# EAGLE design Prius Adaptor PCB Straight (EAGLE 9.4.0)
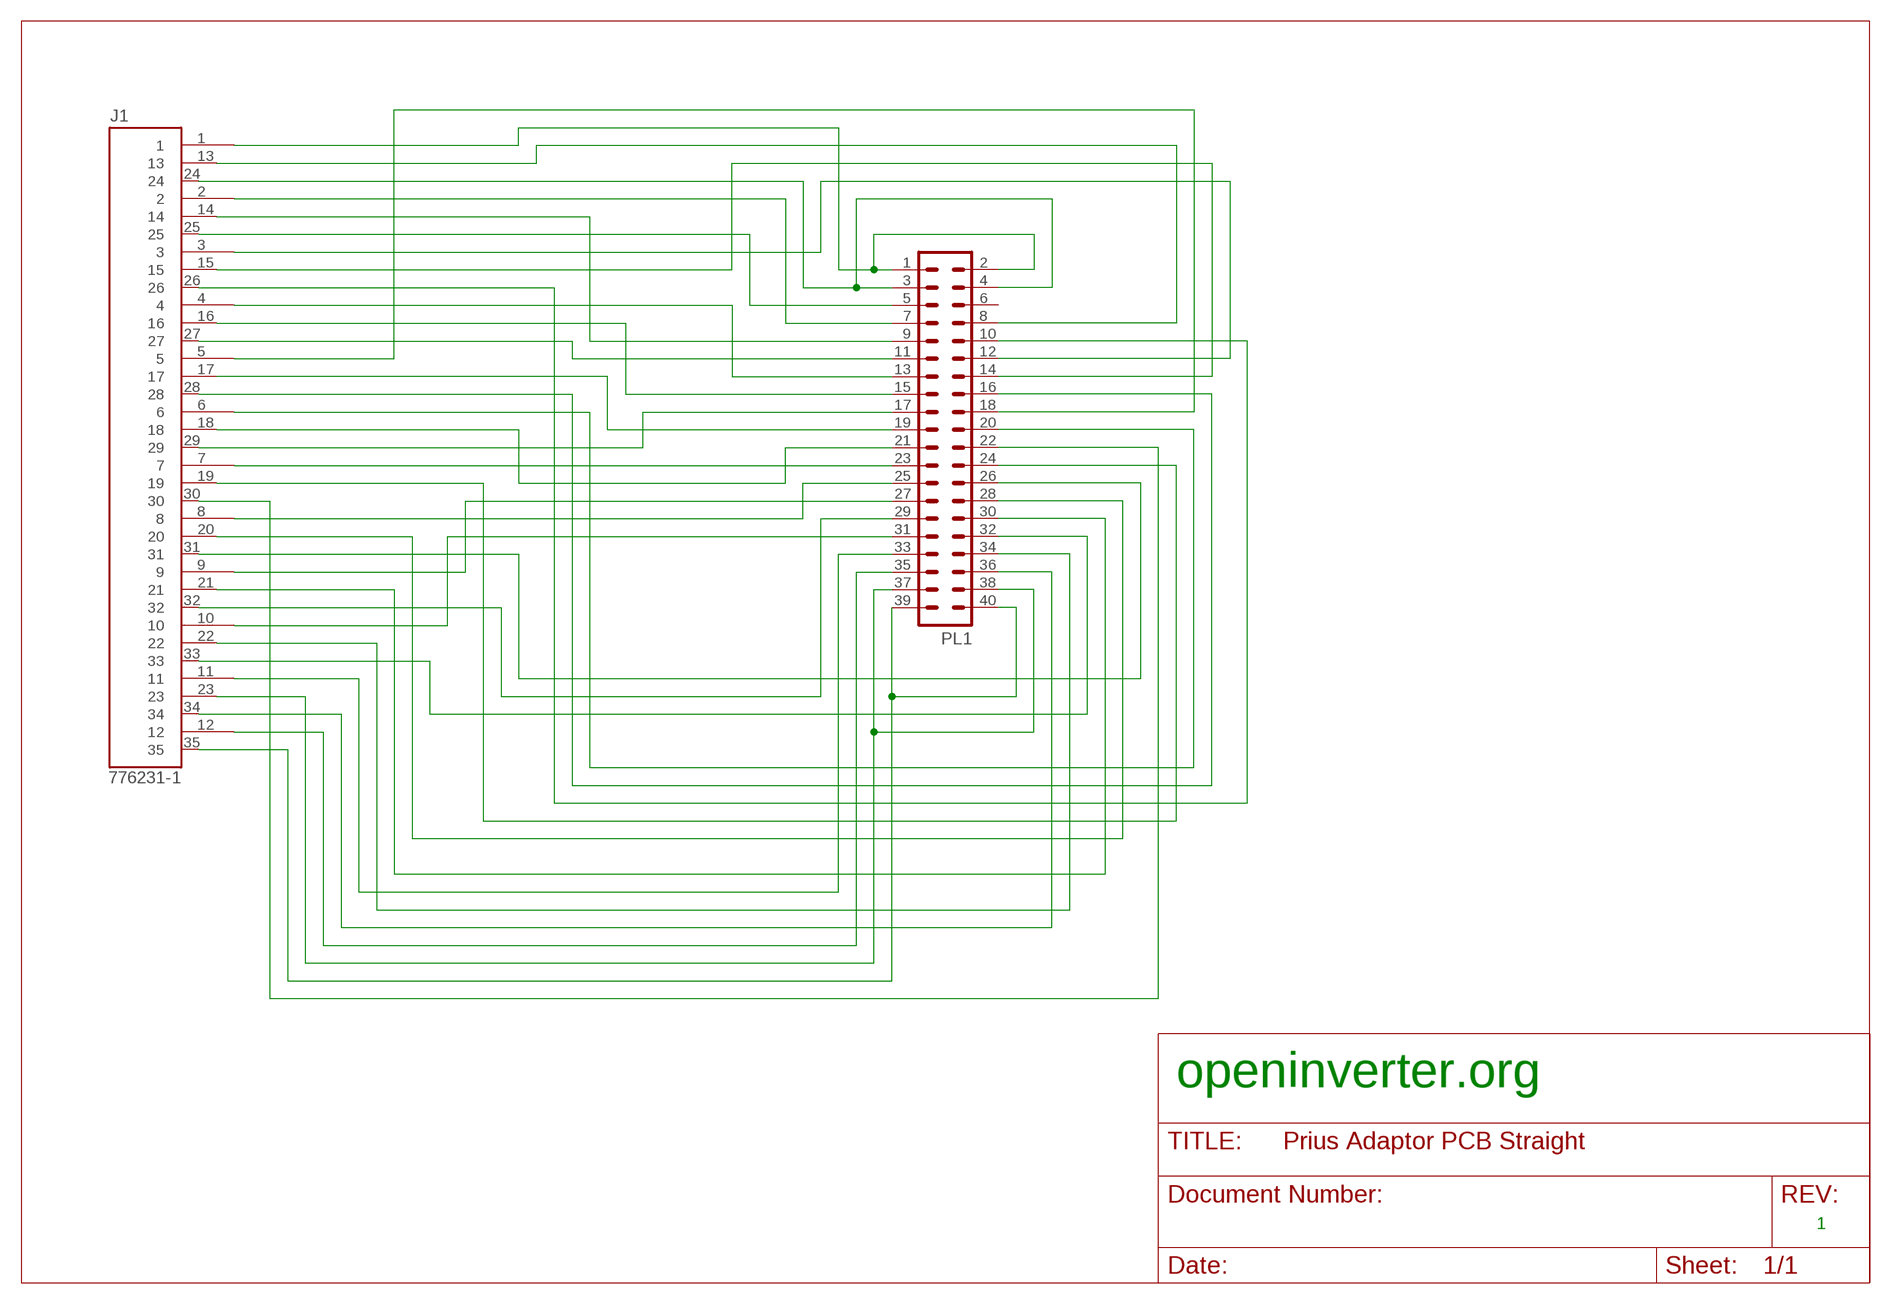
[diagram p0: schematic, sheet 1]

## Parts
J1  776231-1  [TE_776231-1]
PL1  40HNONLATCH  [40HNONLATCH]

## Nets
N$2: J1.6 PL1.20
N$3: J1.29 PL1.17
N$4: J1.5 PL1.18
N$5: J1.16 PL1.15
N$6: J1.28 PL1.16
N$7: J1.4 PL1.13
N$8: J1.15 PL1.14
N$9: J1.27 PL1.11
N$10: J1.17 PL1.19
N$11: J1.14 PL1.9
N$12: J1.26 PL1.10
N$13: J1.2 PL1.7
N$14: J1.13 PL1.8
N$15: J1.25 PL1.5
N$16 [Power]: J1.1 PL1.1 PL1.2
N$17 [Power]: J1.24 PL1.3 PL1.4
N$18: J1.7 PL1.23
N$19: J1.18 PL1.21
N$20: J1.30 PL1.22
N$21: J1.8 PL1.25
N$22: J1.19 PL1.24
N$23: J1.31 PL1.26
N$24: J1.9 PL1.27
N$25: J1.20 PL1.28
N$26: J1.32 PL1.29
N$27: J1.10 PL1.31
N$28: J1.21 PL1.30
N$29: J1.33 PL1.32
N$30: J1.11 PL1.33
N$31: J1.22 PL1.34
N$32: J1.34 PL1.36
N$33: J1.12 PL1.35
N$34 [Power]: J1.23 PL1.37 PL1.38
N$35 [Power]: J1.35 PL1.39 PL1.40
N$36: J1.3 PL1.12
Unconnected: PL1.6

## Notes on the sheet
- openinverter.org
- 1

## Library data of the parts
J1 = Prius Inverter Adaptor:776231-1: CONN HEADER 35POS VERT TIN BLK; MANUFACTURER: TE CONNECTIVITY; PARTREV: A13; STANDARD: MANUFACTURER RECOMMENDATIONS
PL1 = Prius Inverter Adaptor:40HNONLATCH: CONNECTOR

## Net classes
0 default: width 0.4 mm, clearance 0.3 mm
1 Signal: width 0.3 mm, clearance 0.2 mm
2 Power: width 1 mm, clearance 0.3 mm

## Board
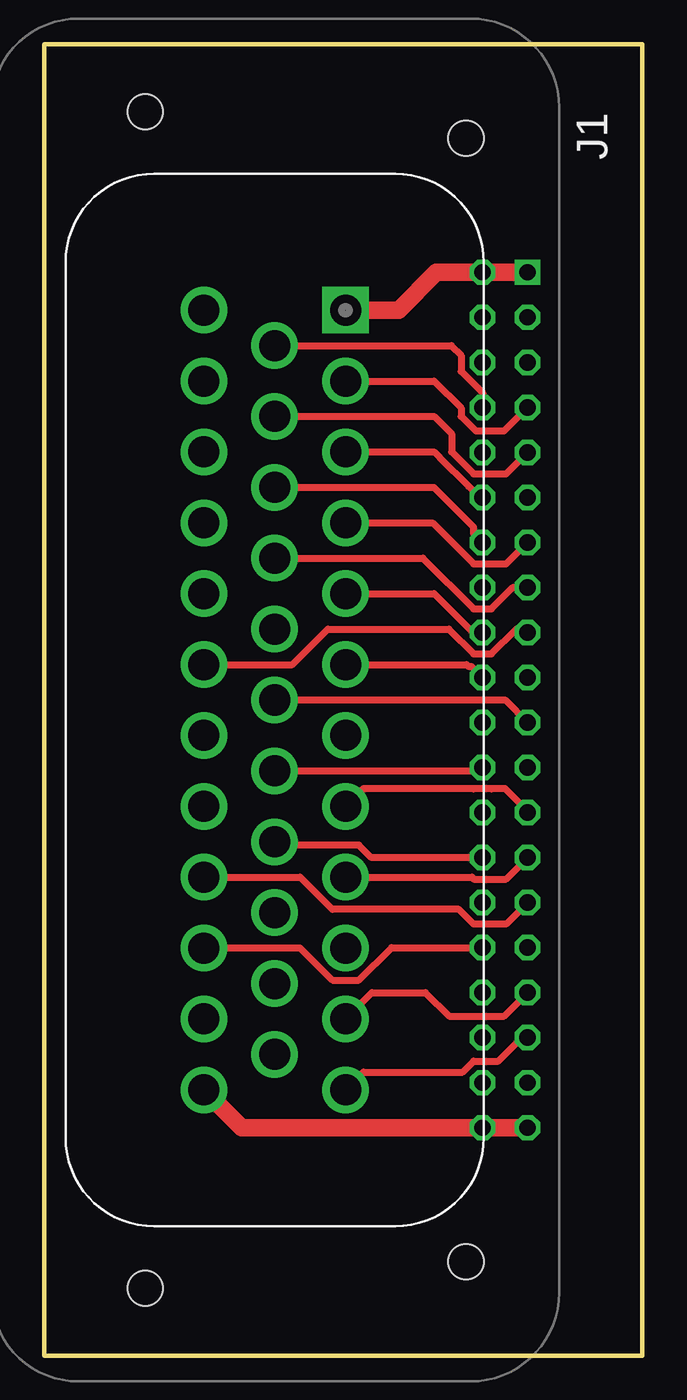
[diagram p1: board, top side]
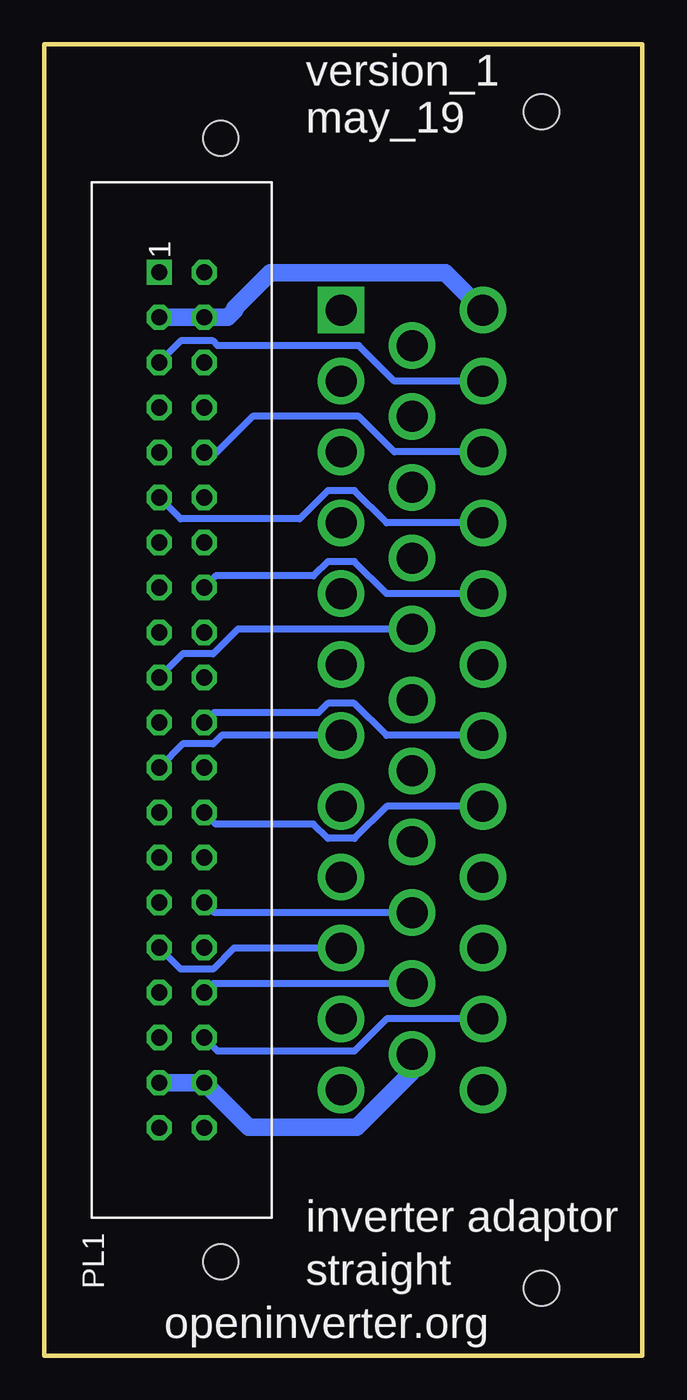
[diagram p2: board, bottom side, seen from below]

Size 33.75 x 74 mm. Coordinates in mm from the lower left corner, seen from the top.
Outline: 0,0 33.75,0 33.75,74 0,74 0,0
Copper layers (1*16): Top 0.035mm / dielectric 1.5mm / Bottom 0.035mm
Design rules "default": minimum track width 6mil, minimum drill 0.35mm, track to track 6mil, track to pad 6mil, pad to pad 6mil, via to via 6mil, smd to smd 6mil, copper to edge 40mil, drill to drill 6mil, minimum pad ring 10mil, minimum via ring 8mil, stop-mask expansion 4mil, vias tented up to drill 0mil, thermal gap 10mil

### Footprints (pad centres in the part's own frame; a part is rotated, then mirrored left to right if it is on the bottom)
TE_776231-1 = drill 1.75 square: 1 -22,4 | drill 1.75: 2 -18,4; 3 -14,4; 4 -10,4; 5 -6,4; 6 -2,4; 7 2,4; 8 6,4; 9 10,4; 10 14,4; 11 18,4; 12 22,4; 13 -20,0; 14 -16,0; 15 -12,0; 16 -8,0; 17 -4,0; 18 0,0; 19 4,0; 20 8,0; 21 12,0; 22 16,0; 23 20,0; 24 -22,-4; 25 -18,-4; 26 -14,-4; 27 -10,-4; 28 -6,-4; 29 -2,-4; 30 2,-4; 31 6,-4; 32 10,-4; 33 14,-4; 34 18,-4; 35 22,-4 | hole 2: -31.7,10.8; -33.2,-7.3; 31.7,10.8; 33.2,-7.3
40HNONLATCH = drill 0.914 square: 1 -24.13,-1.27 | drill 0.914 octagon: 2 -24.13,1.27; 3 -21.59,-1.27; 4 -21.59,1.27; 5 -19.05,-1.27; 6 -19.05,1.27; 7 -16.51,-1.27; 8 -16.51,1.27; 9 -13.97,-1.27; 10 -13.97,1.27; 11 -11.43,-1.27; 12 -11.43,1.27; 13 -8.89,-1.27; 14 -8.89,1.27; 15 -6.35,-1.27; 16 -6.35,1.27; 17 -3.81,-1.27; 18 -3.81,1.27; 19 -1.27,-1.27; 20 -1.27,1.27; 21 1.27,-1.27; 22 1.27,1.27; 23 3.81,-1.27; 24 3.81,1.27; 25 6.35,-1.27; 26 6.35,1.27; 27 8.89,-1.27; 28 8.89,1.27; 29 11.43,-1.27; 30 11.43,1.27; 31 13.97,-1.27; 32 13.97,1.27; 33 16.51,-1.27; 34 16.51,1.27; 35 19.05,-1.27; 36 19.05,1.27; 37 21.59,-1.27; 38 21.59,1.27; 39 24.13,-1.27; 40 24.13,1.27

### Placement (x,y rotation side)
J1  13,37 270 top
PL1  26,37 270 bottom

### Tracks (layer width: path | path; a pad name or v marks a point on that pad's centre or on a via)
N$2
  Top 0.4: J1.6 23.84,39 23.94,38.9 24.1,38.9 PL1.20
N$3
  Top 0.4: J1.29 14,39 16,41 22.83,41 24.23,39.6 25.23,39.6 26.63,41 27.08,41 PL1.17
N$4
  Top 0.4: J1.5 22,43 24.19,40.81 PL1.18
N$5
  Top 0.4: PL1.15 26.44,43.35 25.23,42.14 24.23,42.14 21.37,45 J1.16
N$6
  Bottom 0.4: J1.28 14.44,43 16.25,44.81 17.75,44.81 18.56,44 24.08,44 PL1.16
N$7
  Top 0.4: J1.4 21.91,47 24.23,44.68 26.06,44.68 PL1.13
N$8
  Top 0.4: PL1.14 24.22,46.4 24.22,46.77 21.99,49 J1.15
N$9
  Bottom 0.4: J1.27 14.44,47 16.25,48.81 17.75,48.81 19.34,47.22 26.06,47.22 PL1.11
N$10
  Bottom 0.4: J1.17 22.83,41 24.23,39.6 25.94,39.6 PL1.19
N$11
  Top 0.4: J1.14 22,53 22.99,52.01 22.99,51 24.23,49.76 26.06,49.76 PL1.9
N$12
  Bottom 0.4: J1.26 14,51 16,53 22,53 24.03,50.97 PL1.10
N$13
  Top 0.4: J1.2 22,55 23.52,53.48 23.52,53.01 24.35,52.18 25.94,52.18 PL1.7
N$14
  Top 0.4: J1.13 22.97,57 23.52,56.45 23.52,55.55 24.73,54.34 PL1.8
N$15
  Bottom 0.4: J1.25 14,55 16,57 23.97,57 24.23,57.26 26.06,57.26 PL1.5
N$16
  Top 1: J1.1 20,59 22.13,61.13 PL1.2 PL1.1
N$17
  Bottom 1: J1.24 11.11,61.11 21,61.11 23,59.11 23,59 23.41,58.59 PL1.4 PL1.3
N$18
  Bottom 0.4: J1.7 23.75,35 24.23,34.52 25.94,34.52 PL1.23
N$19
  Top 0.4: PL1.21 26,37 J1.18
N$20
  Bottom 0.4: J1.30 14.44,35 16.25,36.81 17.75,36.81 18.28,36.28 24.18,36.28 PL1.22
N$21
  Top 0.4: PL1.25 27.27,30.73 26,32 25.25,32 25.23,31.98 24.23,31.98 24.21,32 18,32 J1.8
N$22
  Top 0.4: PL1.24 24.54,33 J1.19
N$23
  Bottom 0.4: J1.31 14.44,31 16.25,29.19 17.75,29.19 18.56,30 24.08,30 PL1.26
N$24
  Top 0.4: PL1.27 26.06,26.9 24.23,26.9 24.13,27 J1.9
N$25
  Top 0.4: PL1.28 18.45,28.11 17.75,28.81 13.19,28.81 J1.20
N$26
  Top 0.4: J1.32 14.44,27 16.25,25.19 23.4,25.19 24.23,24.36 26.06,24.36 PL1.29
N$27
  Bottom 0.4: PL1.31 26.06,21.82 24.23,21.82 23.05,23 J1.10
N$28
  Bottom 0.4: J1.21 24.16,25 PL1.30
N$29
  Top 0.4: J1.33 14.44,23 16.25,21.19 17.75,21.19 19.59,23.03 PL1.32
N$30
  Top 0.4: J1.11 18.49,20.49 21.51,20.49 22.84,19.16 25.94,19.16 PL1.33
N$31
  Bottom 0.4: PL1.34 24.22,21 J1.22
N$32
  Bottom 0.4: J1.34 14.44,19 16.25,17.19 23.97,17.19 PL1.36
N$33
  Top 0.4: J1.12 18,16 23.61,16 24.23,16.62 25.62,16.62 27,18 27.22,18 PL1.35
N$34
  Bottom 1: J1.23 13,16.01 16.12,12.89 22.21,12.89 PL1.38 PL1.37
N$35
  Top 1: J1.35 11.13,12.87 PL1.40 PL1.39
N$36
  Top 0.4: J1.3 22,51 22.29,50.71 23.94,49.06 24.57,48.43 PL1.12

### Text on the board
bNames: version_1 / may_19 | inverter adaptor | straight | openinverter.org